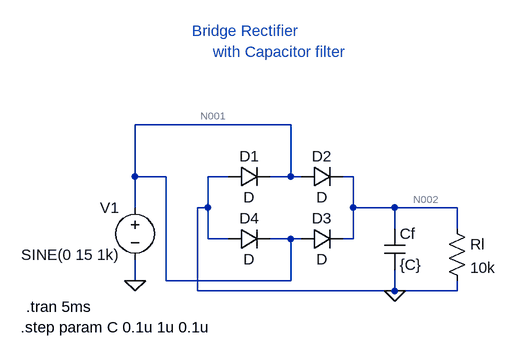
[diagram p0: schematic Rectifier.asc]
Rectifier.asc, the LTspice schematic file:
Version 4
SHEET 1 880 680
WIRE 272 48 32 48
WIRE 32 128 32 48
WIRE 80 128 32 128
WIRE 176 128 144 128
WIRE 272 128 272 48
WIRE 272 128 240 128
WIRE 288 128 272 128
WIRE 368 128 352 128
WIRE 32 176 32 128
WIRE 144 176 144 128
WIRE 144 176 128 176
WIRE 368 176 368 128
WIRE 432 176 368 176
WIRE 528 176 432 176
WIRE 432 208 432 176
WIRE 528 208 528 176
WIRE 144 224 144 176
WIRE 176 224 144 224
WIRE 272 224 240 224
WIRE 288 224 272 224
WIRE 368 224 368 176
WIRE 368 224 352 224
WIRE 32 288 32 256
WIRE 80 288 80 128
WIRE 272 288 272 224
WIRE 272 288 80 288
WIRE 128 304 128 176
WIRE 432 304 432 272
WIRE 432 304 128 304
WIRE 528 304 528 288
WIRE 528 304 432 304
FLAG 32 288 0
FLAG 432 304 0
SYMBOL diode 176 144 R270
WINDOW 0 32 32 VTop 2
WINDOW 3 0 32 VBottom 2
SYMATTR InstName D1
SYMBOL diode 288 144 R270
WINDOW 0 32 32 VTop 2
WINDOW 3 0 32 VBottom 2
SYMATTR InstName D2
SYMBOL diode 288 240 R270
WINDOW 0 32 32 VTop 2
WINDOW 3 0 32 VBottom 2
SYMATTR InstName D3
SYMBOL diode 176 240 R270
WINDOW 0 32 32 VTop 2
WINDOW 3 0 32 VBottom 2
SYMATTR InstName D4
SYMBOL voltage 32 160 R0
WINDOW 0 -54 16 Left 2
WINDOW 3 -175 88 Left 2
WINDOW 123 0 0 Left 0
WINDOW 39 0 0 Left 0
SYMATTR InstName V1
SYMATTR Value SINE(0 15 1k)
SYMBOL cap 416 208 R0
SYMATTR InstName Cf
SYMATTR Value {C}
SYMBOL res 512 192 R0
SYMATTR InstName Rl
SYMATTR Value 10k
TEXT -144 360 Left 2 !.step param C 0.1u 1u 0.1u
TEXT -136 328 Left 2 !.tran 5ms
TEXT 120 -96 Left 2 ;Bridge Rectifier
TEXT 152 -64 Left 2 ;with Capacitor filter

The netlist it stands for:
* Rectifier.asc
D1 0 N001 D
D2 N001 N002 D
D3 N001 N002 D
D4 0 N001 D
V1 N001 0 SINE(0 15 1k)
Cf N002 0 {C}
Rl N002 0 10k
.model D D
.lib standard.dio
.step param C 0.1u 1u 0.1u
.tran 5ms
* Bridge Rectifier
* with Capacitor filter
.backanno
.end

* Results of the author's LTspice run, read from the files saved beside the schematic
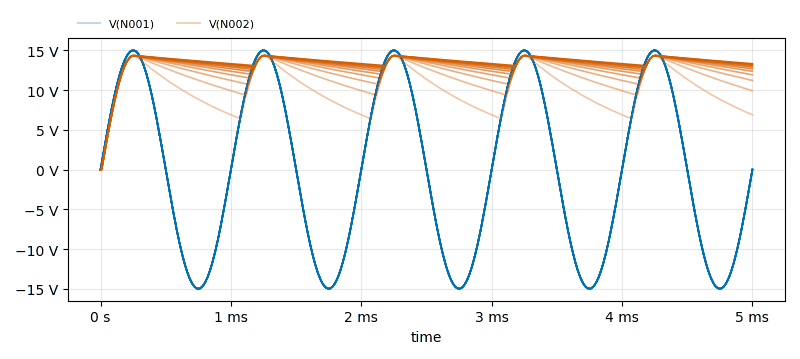
[diagram p1: Transient Analysis of Rectifier.asc, plotted from the saved traces]
* Transient Analysis, 10 runs:
*   V(N001) [c=1e-007]: min -15 V, max 15 V, average 1.388 mV, rms 10.61 V, last 0 V
*   V(N001) [c=2e-007]: min -15 V, max 15 V, average 1.414 mV, rms 10.61 V, last 0 V
*   V(N001) [c=3e-007]: min -15 V, max 15 V, average 1.463 mV, rms 10.61 V, last 0 V
*   V(N001) [c=4e-007]: min -15 V, max 15 V, average 1.557 mV, rms 10.61 V, last 0 V
*   V(N001) [c=5e-007]: min -15 V, max 15 V, average 1.656 mV, rms 10.61 V, last 0 V
*   V(N001) [c=6e-007]: min -15 V, max 15 V, average 1.66 mV, rms 10.61 V, last 0 V
*   V(N001) [c=7e-007]: min -15 V, max 15 V, average 1.631 mV, rms 10.61 V, last 0 V
*   V(N001) [c=8e-007]: min -14.99 V, max 15 V, average 1.534 mV, rms 10.61 V, last 0 V
*   V(N002) [c=1e-007]: min 0 V, max 14.35 V, average 10.14 V, rms 10.46 V, last 6.891 V
*   V(N002) [c=2e-007]: min 0 V, max 14.35 V, average 11.72 V, rms 11.87 V, last 9.923 V
*   V(N002) [c=3e-007]: min 0 V, max 14.35 V, average 12.38 V, rms 12.49 V, last 11.22 V
*   V(N002) [c=4e-007]: min 0 V, max 14.34 V, average 12.75 V, rms 12.85 V, last 11.93 V
*   V(N002) [c=5e-007]: min 0 V, max 14.34 V, average 12.99 V, rms 13.08 V, last 12.37 V
*   V(N002) [c=6e-007]: min 0 V, max 14.34 V, average 13.15 V, rms 13.24 V, last 12.68 V
*   V(N002) [c=7e-007]: min 0 V, max 14.34 V, average 13.27 V, rms 13.35 V, last 12.91 V
*   V(N002) [c=8e-007]: min 0 V, max 14.34 V, average 13.36 V, rms 13.44 V, last 13.08 V